# Altium schematic sheet 01. Cover.SchDoc
size A3
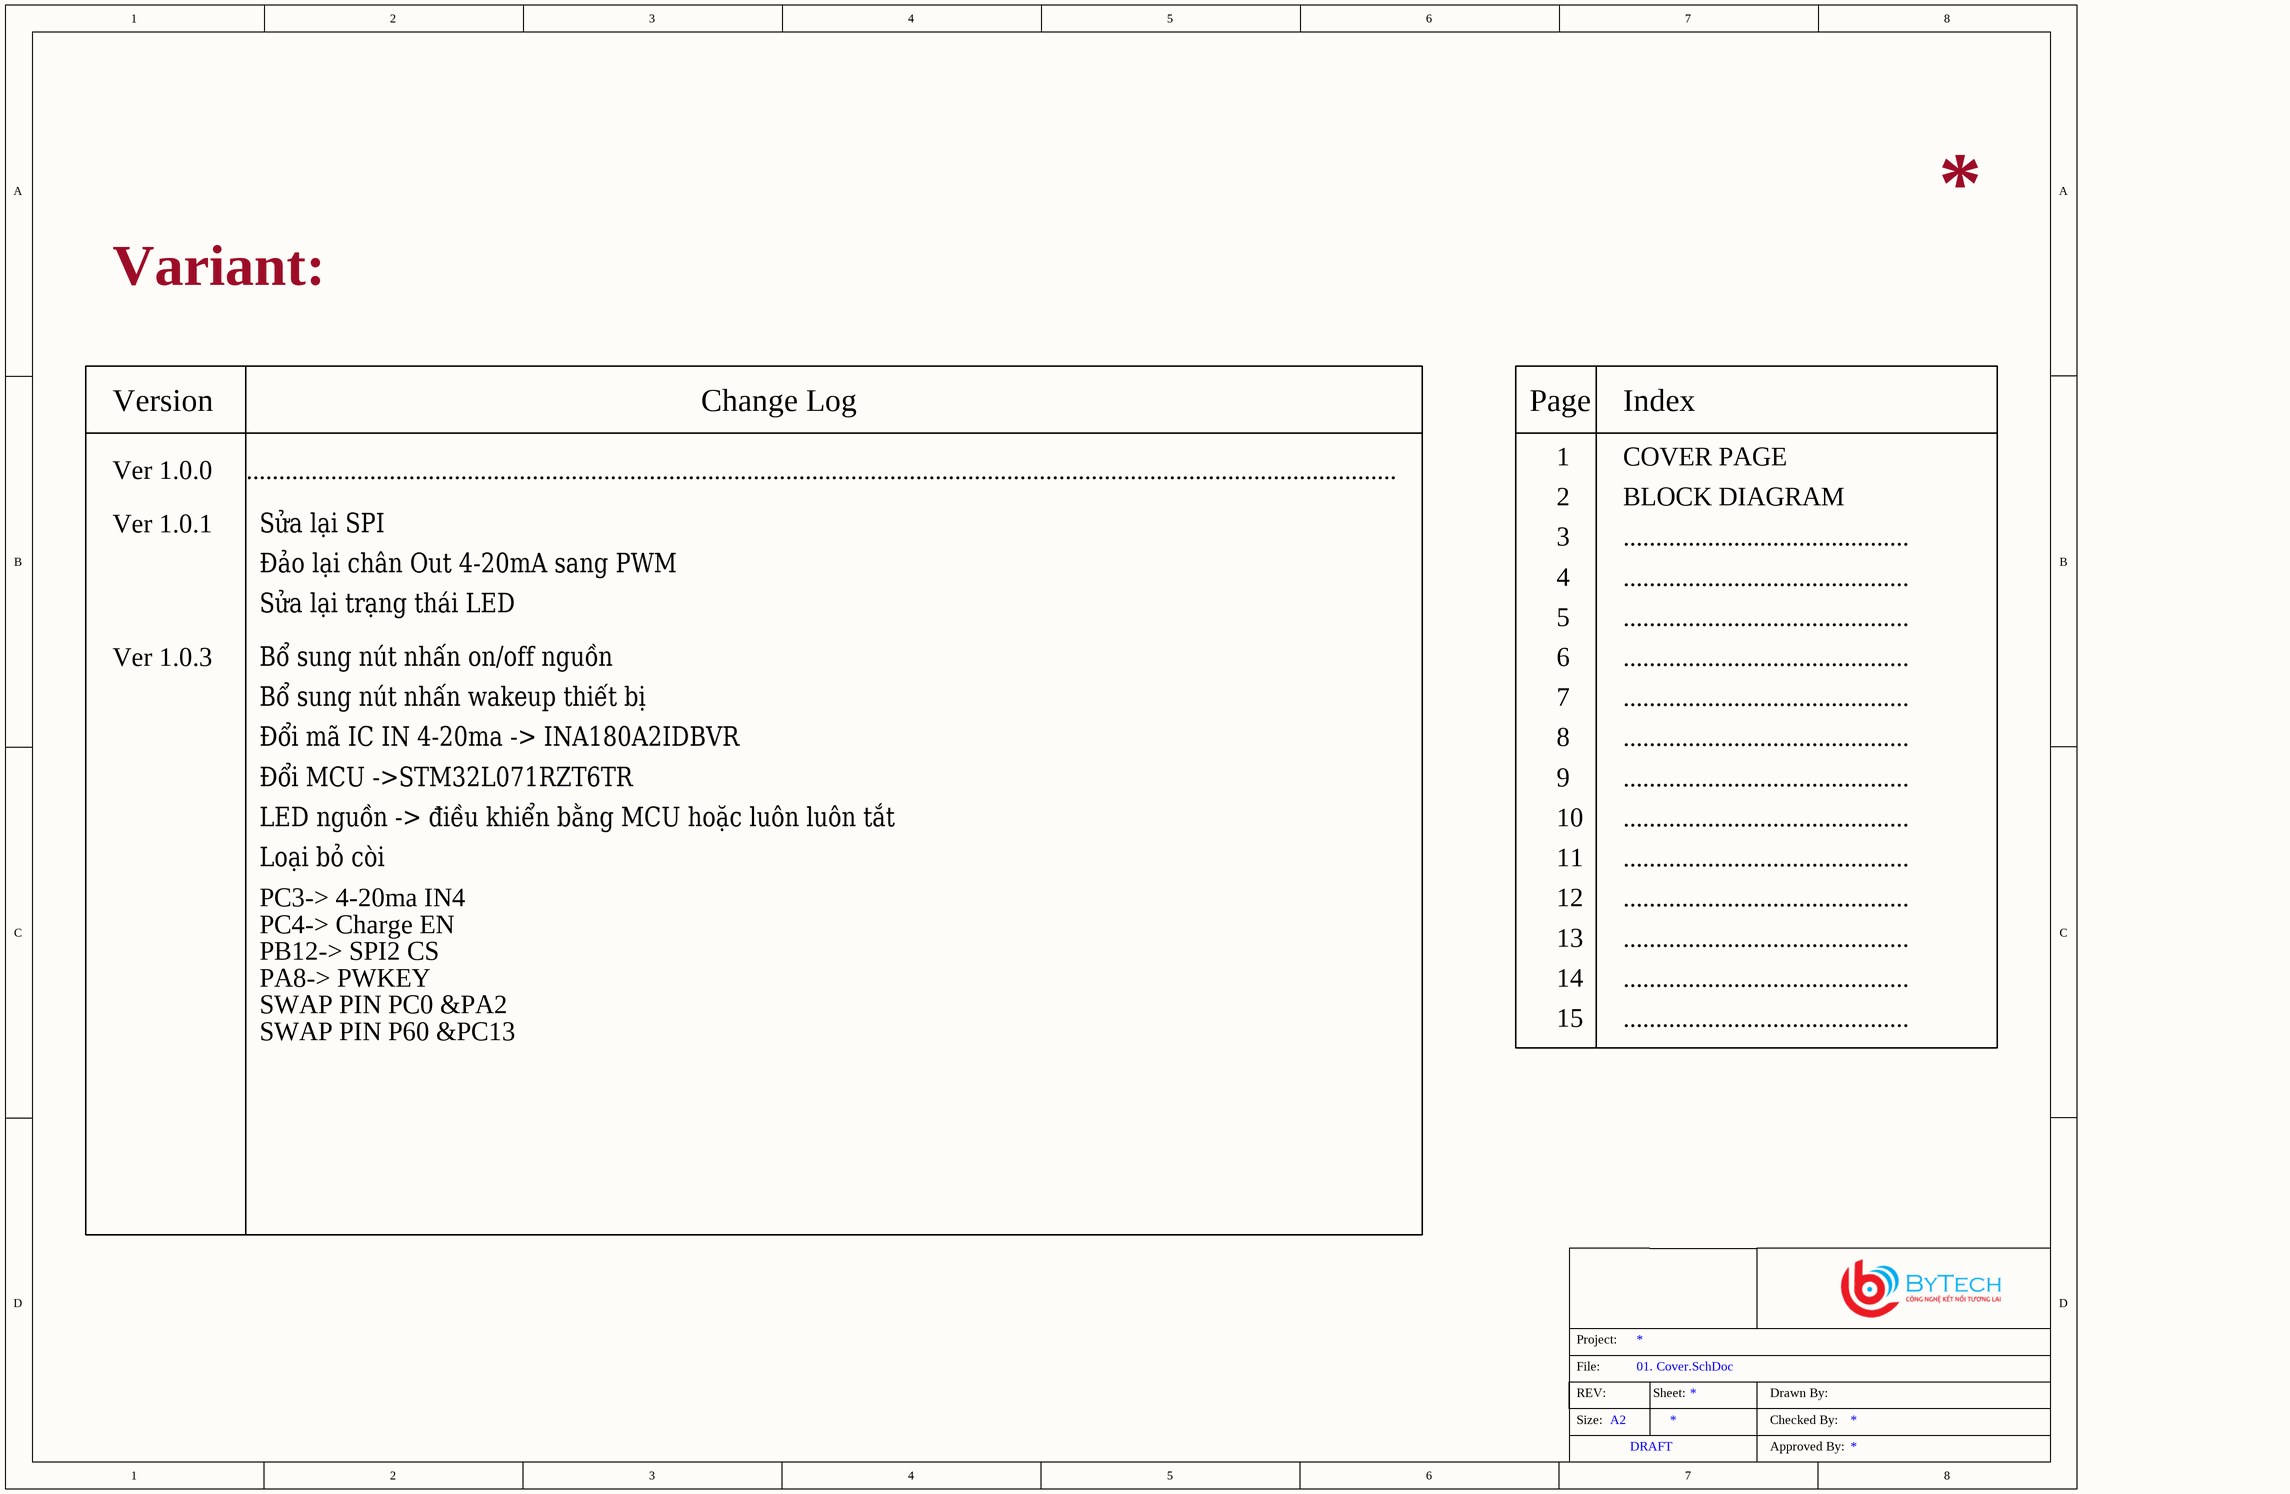
[diagram p0: 01. Cover.SchDoc]

## Notes on the sheet
- Variant:
- Version
- Change Log
- Page
- Index
- Ver 1.0.0
- .................................................................................................................................................................................
- 1
- 2
- COVER PAGE
- BLOCK DIAGRAM
- Ver 1.0.1
- Sửa lại SPI
- Đảo lại chân Out 4-20mA sang PWM
- 3
- ............................................
- Sửa lại trạng thái LED
- 4
- 5
- Ver 1.0.3
- Bổ sung nút nhấn on/off nguồn
- Bổ sung nút nhấn wakeup thiết bị
- 6
- 7
- Đổi mã IC IN 4-20ma -> INA180A2IDBVR
- 8
- Đổi MCU ->STM32L071RZT6TR
- LED nguồn -> điều khiển bằng MCU hoặc luôn luôn tắt
- 9
- 10
- Loại bỏ còi
- PC3-> 4-20ma IN4
- 11
- 12
- PC4-> Charge EN
- PB12-> SPI2 CS
- 13
- PA8-> PWKEY
- SWAP PIN PC0 &PA2
- SWAP PIN P60 &PC13
- 14
- 15
- File:
- Project:
- REV:
- Size:
- A2
- Sheet:
- Drawn By:
- Checked By:
- DRAFT
- Approved By: